# EAGLE design MECHWARFARE_BOARD (EAGLE 9.6.2)
AUTHOR: Cole Stanton / Aaron Tran; BOARD_NAME: 507 PROTOTYPE; DOC_NUM: 1; PROJECT_NAME: 507 DESIGN PROJECT; REVISION: 0
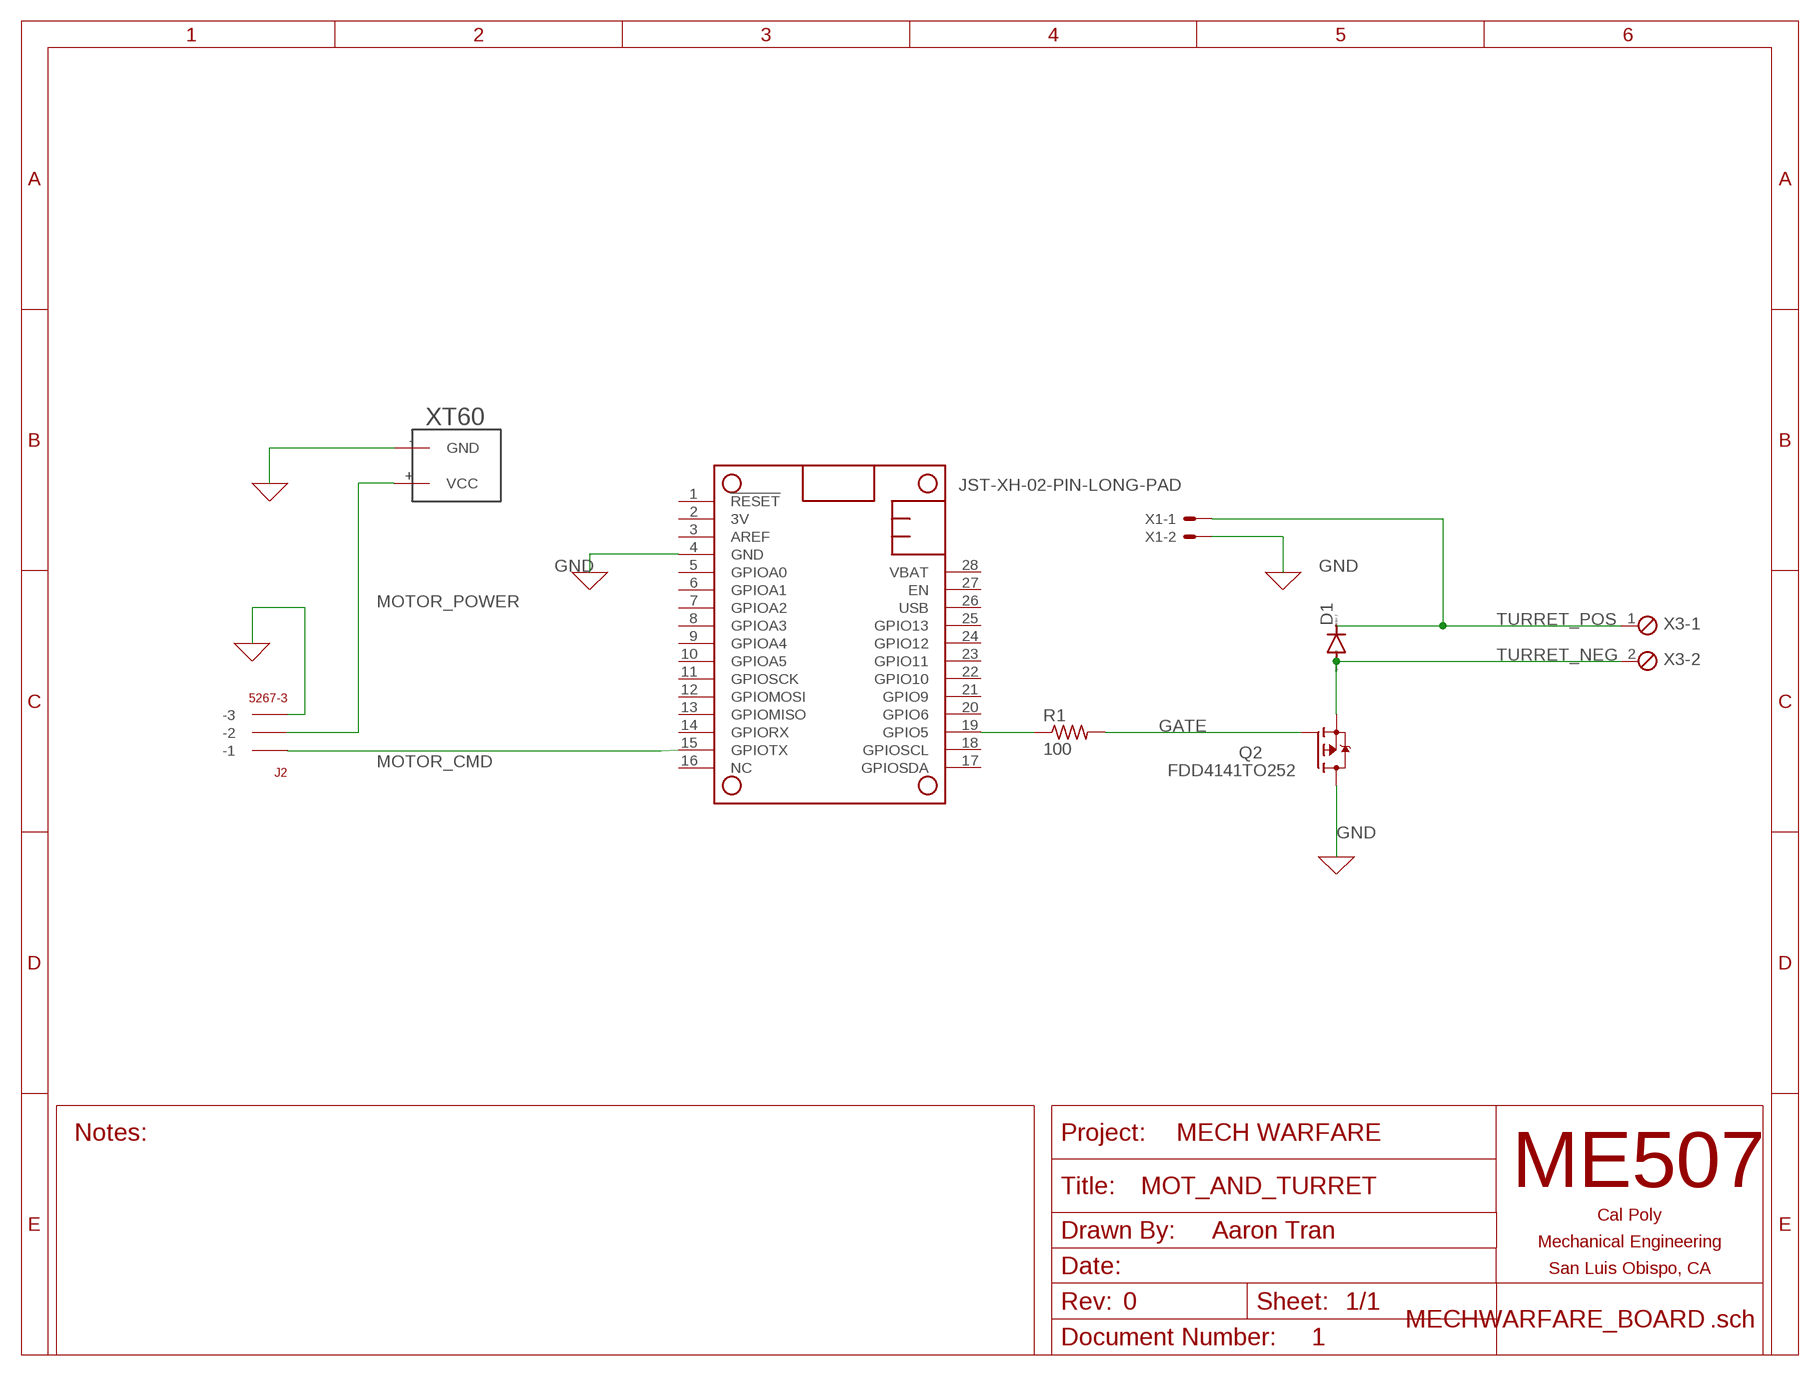
[diagram p0: schematic, sheet 1]
FRAME1 (TITLEBLOCK_LET_L): AUTHOR: Aaron Tran; BOARD_NAME: MOT_AND_TURRET; PROJECT_NAME: MECH WARFARE

## Parts
D1  DIODE-DO-214AC  [DO-214AC]
J2  5267-3  [5267-3]
MS2  FEATHERWINGEXTENDED_BOTH_ENDS  [FEATHERWING]
Q2  FDD4141TO252  [TO252]
R1  100  R-US_R0805  [R0805]
U$1  XT60  [XT60]
X1  JST-XH-02-PIN-LONG-PAD  [JST-XH-02-PACKAGE-LONG-PAD]
X3  SCREWTERM_2P_254  [2POL254]

## Nets
GATE: Q2.1(G) R1.2
GND: J2.P$3(-3) MS2.4(GND) Q2.3(D) U$1.-(GND) X1.2
MOTOR_CMD: J2.P$1(-1) MS2.15(GPIOTX)
MOTOR_POWER: J2.P$2(-2) U$1.+(VCC)
N$21: MS2.19(GPIO5) R1.1
TURRET_NEG: D1.A Q2.2(S) X3.2
TURRET_POS: D1.C X1.1 X3.1
Unconnected: MS2.1(!RESET) MS2.2(3V) MS2.3(AREF) MS2.5(GPIOA0) MS2.6(GPIOA1) MS2.7(GPIOA2) MS2.8(GPIOA3) MS2.9(GPIOA4) MS2.10(GPIOA5) MS2.11(GPIOSCK) MS2.12(GPIOMOSI) MS2.13(GPIOMISO) MS2.14(GPIORX) MS2.16(NC) MS2.17(GPIOSDA) MS2.18(GPIOSCL) MS2.20(GPIO6) MS2.21(GPIO9) MS2.22(GPIO10) MS2.23(GPIO11) MS2.24(GPIO12) MS2.25(GPIO13) MS2.26(USB) MS2.27(EN) MS2.28(VBAT)

## Library data of the parts
D1 = diode:DIODE-: DIODE
J2 = con-molex-spox:5267-3
MS2 = ME507:FEATHERWING: AdaFruitTM Feather Wing A modified version of a Featherwing, the add-on board for an AdaFruit(tm) Feather development board. There is a standard size version which is the same size as the Feather board on which the microcontroller hangs out. There is also an extended version, with each and longer by a quarter inch to allow for connectors such as screw terminals which aren't hidden under another board if this wing isn't on the top of the board stack. The pins are named in a generic fashion; these names do not necessarily correspond to Arduino or Python pin numbers. The designer must refer to the pinout diagram for each specific Feather board to find the functions of each pin.
Q2 = transistor-fet:FDD4141: P-Channel PowerTrench® MOSFET Source: FDD4141.pdf
R1 = rcl:R-US_: RESISTOR, American symbol; SPICEPREFIX: R
U$1 = XT60:XT60: XT60
X1 = Rembrandt Electronics - JST XH Connectors v1-0:JST-XH-02-PIN: JST XH Connector 2 Pin Wire to board connector. Pitch: 2,54 mm, (0.100") Number of pins: 2 Created by Rembrandt Electronics www.rembrandtelectronics.com
X3 = ME507:SCREWTERM_2P: Screw Terminal Block This part is designed for a screw terminal connector. The 2.54mm (0.100 inch) foorprint can also be used for male or female pin headers such as those on most development boards. One can also solder wires directly into the holes, though this makes modifications or repairs to the system more inconvenient. Larger versions can carry more current.

## Board
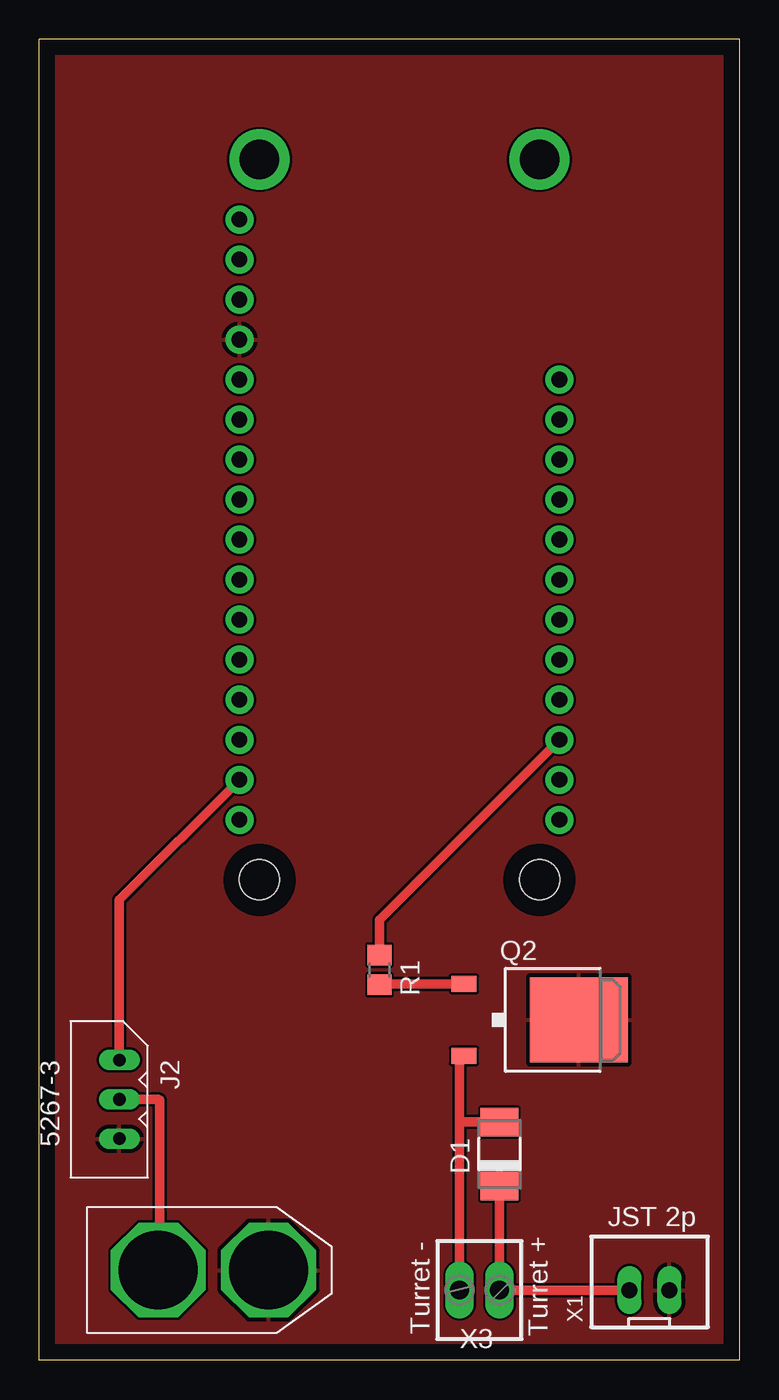
[diagram p1: board, top side]

Size 44.45 x 83.82 mm. Coordinates in mm from the lower left corner, seen from the top.
Copper layers (1*16): Top 0.035mm / dielectric 1.5mm / Bottom 0.035mm
Design rules "default": minimum track width 6mil, minimum drill 0.35mm, track to track 6mil, track to pad 6mil, pad to pad 6mil, via to via 6mil, smd to smd 6mil, copper to edge 40mil, drill to drill 6mil, minimum pad ring 10mil, minimum via ring 8mil, stop-mask expansion 4mil, vias tented up to drill 0mil, thermal gap 10mil

### Footprints (pad centres in the part's own frame; a part is rotated, then mirrored left to right if it is on the bottom)
DO-214AC = smd 1.8 x 2.4: A 2.025,0; C -2.025,0
5267-3 = drill 0.8 long: P$1 0,0; P$2 2.5,0; P$3 5,0
FEATHERWING = drill 1 pad 1.778: 1 6.35,1.27; 2 8.89,1.27; 3 11.43,1.27; 4 13.97,1.27; 5 16.51,1.27; 6 19.05,1.27; 7 21.59,1.27; 8 24.13,1.27; 9 26.67,1.27; 10 29.21,1.27; 11 31.75,1.27; 12 34.29,1.27; 13 36.83,1.27; 14 39.37,1.27; 15 41.91,1.27; 16 44.45,1.27; 17 44.45,21.59; 18 41.91,21.59; 19 39.37,21.59; 20 36.83,21.59; 21 34.29,21.59; 22 31.75,21.59; 23 29.21,21.59; 24 26.67,21.59; 25 24.13,21.59; 26 21.59,21.59; 27 19.05,21.59; 28 16.51,21.59 | drill 2.5 pad 3.81: P$1 2.54,20.32; P$2 2.54,2.54 | hole 2.54: 48.26,20.32; 48.26,2.54
TO252 = smd 1 x 1.6: 1 -2.28,-4.8; 2 2.28,-4.8 | smd 5.4 x 6.2: 3 0,2.5
R0805 = smd 1.3 x 1.5: 1 -0.95,0; 2 0.95,0
XT60 = drill 5 octagon: + 4.5,0; - 11.5,0
JST-XH-02-PACKAGE-LONG-PAD = drill 1.016 long: 1 -1.27,0; 2 1.27,0
2POL254 = drill 1.2 long: 1 -1.27,0; 2 1.27,0

### Placement (x,y rotation side)
D1  29.21,13.08 90 top
J2  5.08,19.05 270 top
MS2  11.43,78.74 270 top
Q2  31.75,21.59 270 top
R1  21.59,24.77 270 top
U$1  3.05,5.71 0 top
X1  38.73,4.45 0 top
X3  27.94,4.45 180 top

### Tracks (layer width: path | path; a pad name or v marks a point on that pad's centre or on a via)
GATE
  Top 0.61: R1.2 21.64,23.87 Q2.1
GND
  pour Top: 0,83.82 0,0 44.45,0 44.45,83.82
MOTOR_CMD
  Top 0.61: J2.P$1 5.08,29.21 MS2.15
MOTOR_POWER
  Top 0.508: J2.P$2 6.35,16.55
  Top 0.61: J2.P$2 7.58,16.55 7.62,16.51 7.62,5.79 U$1.+
N$21
  Top 0.61: R1.1 21.59,27.94 MS2.19
TURRET_NEG
  Top 0.61: 27.18,19.07 Q2.2 26.67,19.03 X3.2 26.67,15.11 D1.A
TURRET_POS
  Top 0.61: 29.21,11.77 D1.C X3.1 X1.1

### Text on the board
tNames: JST 2p | Turret - | Turret +
bNames: KL AT CS | Mech Warfare 2022